# EAGLE design mydpi (EAGLE 9.6.2)
CHECKED_BY: -; DRAWN_BY: zaan; REV: 1.1; TITLE: myDPI
Assembly variants: BOM
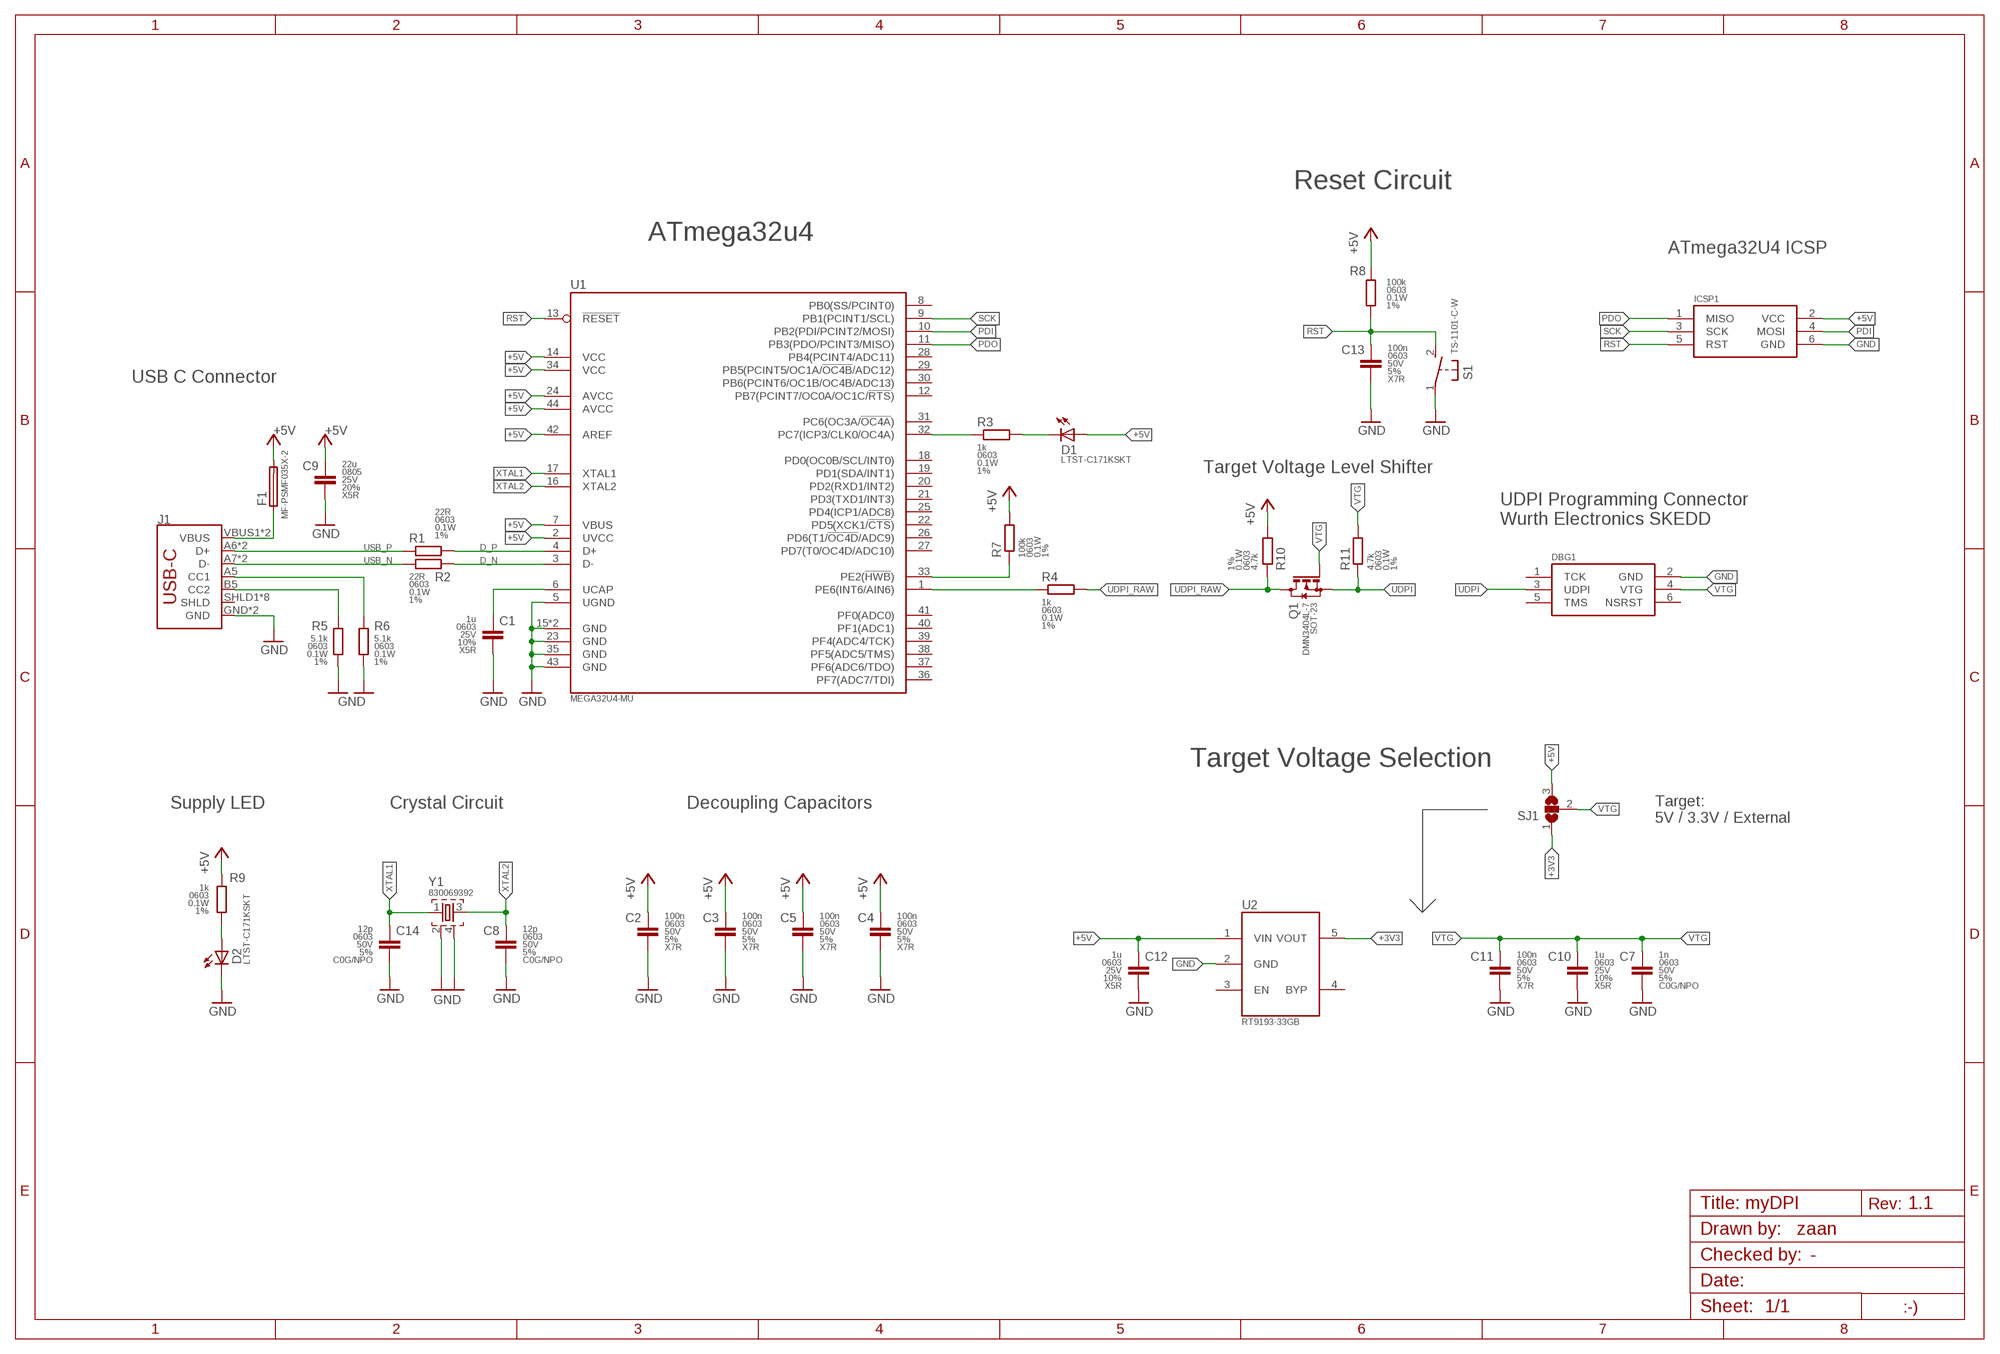
[diagram p0: schematic, sheet 1]

## Parts
C1  1u  1UF-0603-25V-10%  [C0603]
C2  100n  100NF-0603-50V-5%  [C0603]
C3  100n  100NF-0603-50V-5%  [C0603]
C4  100n  100NF-0603-50V-5%  [C0603]
C5  100n  100NF-0603-50V-5%  [C0603]
C7  1n  1NF-0603-50V-5%  [C0603]
C8  12p  12PF-0603-50V-5%  [C0603]
C9  22u  22UF-0805-25V-20%  [C0805]
C10  1u  1UF-0603-25V-10%  [C0603]
C11  100n  100NF-0603-50V-5%  [C0603]
C12  1u  1UF-0603-25V-10%  [C0603]
C13  100n  100NF-0603-50V-5%  [C0603]
C14  12p  12PF-0603-50V-5%  [C0603]
D1  LTST-C171KSKT  [CHIPLED_0805]
D2  LTST-C171KSKT  [CHIPLED_0805]
DBG1  AVR-UPDI-6-SKEDD  [490107670612_DEBUGGING]  (not fitted in variant BOM)
F1  MF-PSMF035X-2  [F0805]
ICSP1  AVR-ISP-SMD  [AVRISP-1.27-SMD]  (not fitted in variant BOM)
J1  USB_C2-LAYER  [USB-C-16P]
Q1  DMN3404L  [SOT23]
R1  22R  22OHM-0603-1/10W-1%  [R0603]
R2  22R  22OHM-0603-1/10W-1%  [R0603]
R3  1k  1KOHM-0603-1/10W-1%  [R0603]
R4  1k  1KOHM-0603-1/10W-1%  [R0603]
R5  5.1k  5.1KOHM-0603-1/10W-1%  [R0603]
R6  5.1k  5.1KOHM-0603-1/10W-1%  [R0603]
R7  100k  100KOHM-0603-1/10W-1%  [R0603]
R8  100k  100KOHM-0603-1/10W-1%  [R0603]
R9  1k  1KOHM-0603-1/10W-1%  [R0603]
R10  4.7k  4.7KOHM-0603-1/10W-1%  [R0603]
R11  4.7k  4.7KOHM-0603-1/10W-1%  [R0603]
S1  TS-1101-C-W  [SPST-6X3.6]
SJ1  SJ2W  [SJ_2]  (not fitted in variant BOM)
U1  MEGA32U4-MU  [TQFN44_7MM]
U2  RT9193-33GB  [SOT23-5]
Y1  830069392  [WE-XTAL_CFPX-218]

## Nets
+3V3: SJ1.1 U2.5(VOUT)
+5V: C2.1 C3.1 C4.1 C5.1 C9.1 C12.1 D1.A F1.2 ICSP1.2(VCC) R7.2 R8.2 R9.1 R10.2 SJ1.3 U1.2(UVCC) U1.7(VBUS) U1.14(VCC) U1.24(AVCC) U1.34(VCC) U1.42(AREF) U1.44(AVCC) U2.1(VIN)
D_N [usb]: R2.2 U1.3(D-)
D_P [usb]: R1.2 U1.4(D+)
GND: C1.2 C2.2 C3.2 C4.2 C5.2 C7.2 C8.2 C9.2 C10.2 C11.2 C12.2 C13.2 C14.2 D2.C DBG1.2(GND) ICSP1.6(GND) J1.GND J1.GND2(GND) R5.1 R6.1 S1.1(P) U1.5(UGND) U1.15(GND) U1.23(GND) U1.35(GND) U1.43(GND) U1.EXP(GND) U2.2(GND) Y1.2 Y1.4
N$1: R3.1 U1.32(PC7(ICP3/CLK0/OC4A))
N$2: D1.C R3.2
N$5: J1.B5(CC2) R5.2
N$6: J1.A5(CC1) R6.2
N$7: R7.1 U1.33(PE2(!HWB!))
N$8: C1.1 U1.6(UCAP)
N$9: D2.A R9.2
N$12: F1.1 J1.VBUS1(VBUS) J1.VBUS2(VBUS)
PDI: ICSP1.4(MOSI) U1.10(PB2(PDI/PCINT2/MOSI))
PDO: ICSP1.1(MISO) U1.11(PB3(PDO/PCINT3/MISO))
PE6: R4.1 U1.1(PE6(INT6/AIN6))
RST: C13.1 ICSP1.5(RST) R8.1 S1.2(S) U1.13(!RESET!)
SCK: ICSP1.3(SCK) U1.9(PB1(PCINT1/SCL))
UDPI: DBG1.3(UDPI) Q1.2(S) R11.1
UDPI_RAW: Q1.3(D) R4.2 R10.1
USB_N [usb]: J1.A7(D-) J1.B7(D-) R2.1
USB_P [usb]: J1.A6(D+) J1.B6(D+) R1.1
VTG: C7.1 C10.1 C11.1 DBG1.4(VTG) Q1.1(G) R11.2 SJ1.2
XTAL1: C14.1 U1.17(XTAL1) Y1.1
XTAL2: C8.1 U1.16(XTAL2) Y1.3
Unconnected: DBG1.1(TCK) DBG1.5(TMS) DBG1.6(NSRST) J1.SHLD1(SHLD) J1.SHLD2(SHLD) J1.SHLD3(SHLD) J1.SHLD4(SHLD) J1.SHLD5(SHLD) J1.SHLD6(SHLD) J1.SHLD7(SHLD) J1.SHLD8(SHLD) U1.8(PB0(SS/PCINT0)) U1.12(PB7(PCINT7/OC0A/OC1C/!RTS!)) U1.18(PD0(OC0B/SCL/INT0)) U1.19(PD1(SDA/INT1)) U1.20(PD2(RXD1/INT2)) U1.21(PD3(TXD1/INT3)) U1.22(PD5(XCK1/!CTS!)) U1.25(PD4(ICP1/ADC8)) U1.26(PD6(T1/!OC4D!/ADC9)) U1.27(PD7(T0/OC4D/ADC10)) U1.28(PB4(PCINT4/ADC11)) U1.29(PB5(PCINT5/OC1A/!OC4B!/ADC12)) U1.30(PB6(PCINT6/OC1B/OC4B/ADC13)) U1.31(PC6(OC3A/!OC4A!)) U1.36(PF7(ADC7/TDI)) U1.37(PF6(ADC6/TDO)) U1.38(PF5(ADC5/TMS)) U1.39(PF4(ADC4/TCK)) U1.40(PF1(ADC1)) U1.41(PF0(ADC0)) U2.3(EN) U2.4(BYP)

## Notes on the sheet
- Reset Circuit
- ATmega32u4
- ATmega32U4 ICSP
- USB C Connector
- Target Voltage Level Shifter
- UDPI Programming Connector
  Wurth Electronics SKEDD
- Target Voltage Selection
- Supply LED | Crystal Circuit | Decoupling Capacitors
- Target:
  5V / 3.3V / External

## Library data of the parts
C1 C10 C12 = zaan-Capacitors:1UF: 1uF capacitor; DESCRIPTION: Chip Capacitor; DIELECTRIC: X5R; MF: Yageo; MPN: CC0603KRX5R8BB105; PACKAGE: 1606; PACKAGE-IN: 0603; TOLERANCE: 10%; VOLTAGE: 25V
C2-C5 C11 C13 = zaan-Capacitors:100NF: 100nF capacitor; DESCRIPTION: Chip Capacitor; DIELECTRIC: X7R; MF: Yageo; MPN: CC0603JRX7R9BB104; PACKAGE: 1606; PACKAGE-IN: 0603; TOLERANCE: 5%; VOLTAGE: 50V
C7 = zaan-Capacitors:1NF: 1nF capacitor; DESCRIPTION: Chip Capacitor; DIELECTRIC: C0G/NPO; MF: Yageo; MPN: CC0603JRNPO9BN102; PACKAGE: 1608; PACKAGE-IN: 0603; TOLERANCE: 5%; VOLTAGE: 50V
C8 C14 = zaan-Capacitors:12PF: 12pF capacitor; DESCRIPTION: Chip Capacitor; DIELECTRIC: C0G/NPO; MF: Yageo; MPN: CC0603JRNPO9BN120; PACKAGE: 1606; PACKAGE-IN: 0603; TOLERANCE: 5%; VOLTAGE: 50V
C9 = zaan-Capacitors:22UF: 22uF capacitor; DESCRIPTION: Chip Capacitor; DIELECTRIC: X5R; MF: Murata; MPN: GRM21BR61E226ME44L; PACKAGE: 2012; PACKAGE-IN: 0805; TOLERANCE: 20%; VOLTAGE: 25V
D1 D2 = zaan-Optoelectronics:LTST: SMD LED Footprint: 0805 Source: Datasheet <http://optoelectronics.liteon.com/upload/download/ds22-2000-110/ltst-c171kskt.pdf> Manufacturer: Lite-On; DESCRIPTION: Surface Mount LED; MF: Lite-On; MPN: LTST-C171KSKT; PACKAGE: 2012; PACKAGE-IN: 0805
DBG1 = zaan-Connectors:AVR-UPDI-6
F1 = zaan-Fuses:MF-PSMF: PTC Resetable Fuse MF-PSMF Series - PTC Resettable Fuses Footprint: 0805 Source: Datasheet <https://www.bourns.com/data/global/pdfs/mfpsmf.pdf> Manufacturer: Bourns; DESCRIPTION: PTC Fuse; MF: Bourns; MPN: MF-PSMF035X-2; PACKAGE: 2012
ICSP1 = zaan-Connectors:AVR-ISP
J1 = zaan-Connectors:USB_C: USB Type C 16 Pin Connector Female 16 Pin Connector Footprint: USB-C 16P Source: Datasheet <https://datasheet.lcsc.com/szlcsc/1811101520_Jing-Extension-of-the-Electronic-Co-C167321_C167321.pdf> Manufacturer: Jing Extension of the Electronic Co. Super Speed pins not available on the 16-pin purely SMD connector so this part is best for USB 2.0 implementations. D1 and D2 are tied together enabling D+/- no matter which way the cable is plugged into the connector. The two channel configuration pins (CC1/2) are exposed. These are normally connected to ground via 5.1k resistors but can be reconfigured for high current/high power applications.; DESCRIPTION: USB Type C Female; MF: Jing Extension; MPN: C167321; PACKAGE: USB-C 16P
Q1 = zaan-Discrete:DMN3404L: N-CHANNEL MOS FET N-Channel Logic Level Enhancement Mode Field Effect Transistor Footprint: SOT-23 Source: Datasheet <https://www.diodes.com/assets/Datasheets/ds31787.pdf> Manufacturer: Diodes Incorporated; DESCRIPTION: N-CHANNEL MOSFET; MF: Diodes Incorporated; MPN: DMN3404L-7; PACKAGE: SOT-23
R1 R2 = zaan-Resistors:22OHM: 22Ω resistor; DESCRIPTION: Chip Resistor; MF: Yageo; MPN: RC0603FR-0722RL; PACKAGE: 1608; PACKAGE-IN: 0603; POWER: 0.1W; TOLERANCE: 1%; VOLTAGE: 75V
R3 R4 R9 = zaan-Resistors:1KOHM: 1kΩ resistor; DESCRIPTION: Chip Resistor; MF: Yageo; MPN: RC0603FR-071KL; PACKAGE: 1608; PACKAGE-IN: 0603; POWER: 0.1W; TOLERANCE: 1%; VOLTAGE: 75V
R5 R6 = zaan-Resistors:5.1KOHM: 5.1kΩ resistor; DESCRIPTION: Chip Resistor; MF: Yageo; MPN: RC0603FR-075K1L; PACKAGE: 1608; PACKAGE-IN: 0603; POWER: 0.1W; TOLERANCE: 1%; VOLTAGE: 75V
R7 R8 = zaan-Resistors:100KOHM: 100kΩ resistor; DESCRIPTION: Chip Resistor; MF: Yageo; MPN: RC0603FR-07100KL; PACKAGE: 1608; PACKAGE-IN: 0603; POWER: 0.1W; TOLERANCE: 1%; VOLTAGE: 75V
R10 R11 = zaan-Resistors:4.7KOHM: 4.7kΩ resistor; DESCRIPTION: Chip Resistor; MF: Yageo; MPN: RC0603FR-074K7L; PACKAGE: 1608; PACKAGE-IN: 0603; POWER: 0.1W; TOLERANCE: 1%; VOLTAGE: 75V
S1 = zaan-Electromechanical:TS-1101-C: Tactile Button SPST Footprint: 6.1X3.6X2.5 Source: Datasheet <https://datasheet.lcsc.com/szlcsc/1811082126_Korean-Hroparts-Elec-K2-1107ST-A4SW-06_C118141.pdf> Manufacturer: ON Semiconductor; DESCRIPTION: Tactile Button; MF: Korean Hroparts Elec; MPN: K2-1107ST-A4SW-06; PACKAGE: 6.1X3.6X2.5
SJ1 = jumper:SJ2W: SMD solder JUMPER
U1 = zaan-IC-Microcontroller:MEGA32U4: ATmega32u4 8-bit Microcontroller with 16/32K bytes of ISP Flash and USB Controller Footprint: QFN-44 Source: Datasheet <http://ww1.microchip.com/downloads/en/devicedoc/atmel-7766-8-bit-avr-atmega16u4-32u4_datasheet.pdf> Manufacturer: Atmel; DESCRIPTION: Microcontroller; MF: Atmel; MPN: ATMEGA32U4-MU; PACKAGE: QFN-44
U2 = zaan-IC-Power:RT9193: LDO Regulator 300mA, Ultra-Low Noise, Ultra-Fast CMOS LDO Regulator Footprint: SOT-23-5 Source: Datasheet <https://www.richtek.com/assets/product_file/RT9193/DS9193-16.pdf> Manufacturer: Richtek; DESCRIPTION: Low Dropout Regulator; MF: Richtek; MPN: RT9193-33GB; PACKAGE: SOT-23-5
Y1 = zaan-Electromechanical:830069: Crystal SMD Crystal Footprint: 2520 Source: Datasheet <https://www.we-online.de/katalog/de/WE-XTAL/> Manufacturer: Wurth Electronics; DESCRIPTION: Crystal; MF: Wurth Electronics; MPN: 830069392; PACKAGE: 2520

## Net classes
0 default: width 0.254 mm, drill 0.3 mm
1 usb: width 0.254 mm, drill 0.3 mm, clearance 0.2 mm

## Board
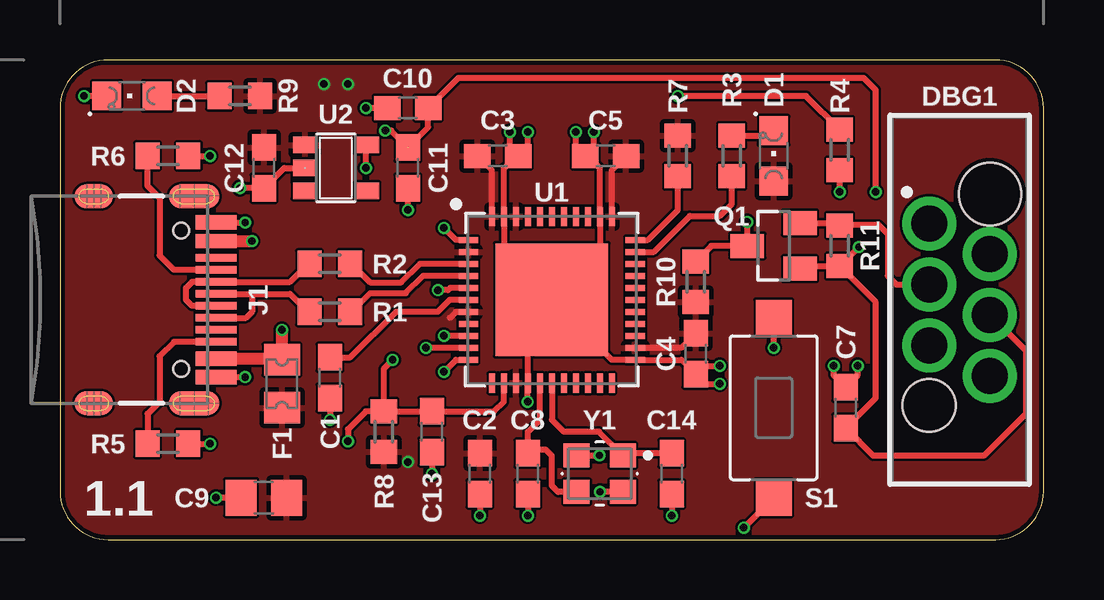
[diagram p1: board, top side]
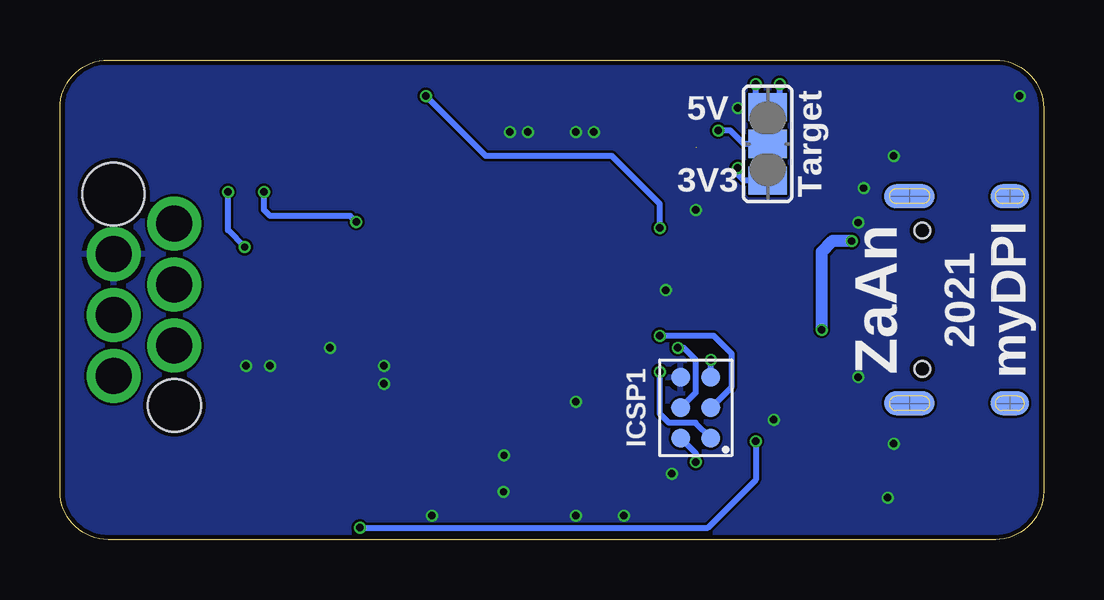
[diagram p2: board, bottom side, seen from below]

Size 41 x 20 mm. Coordinates in mm from the lower left corner, seen from the top.
Outline: 0,18 0,2 arc90 2,0 39,0 arc90 41,2 41,18 arc90 39,20 2,20 arc90 0,18
Copper layers (1*16): Top 0.035mm / dielectric 1.55mm / Bottom 0.035mm
Design rules "Multi-CB_2L *": minimum track width 0.1mm, minimum drill 0.2mm, track to track 0.1mm, track to pad 0.1mm, pad to pad 0.1mm, via to via 0.1mm, smd to smd 0mil, copper to edge 0.2mm, drill to drill 0.2mm, minimum pad ring 0.125mm, minimum via ring 0.1mm, stop-mask expansion 2mil, vias tented up to drill 0.45mm, thermal gap 0.2mm

### Footprints (pad centres in the part's own frame; a part is rotated, then mirrored left to right if it is on the bottom)
C0603 = smd 1.1 x 1: 1 -0.85,0; 2 0.85,0
C0805 = smd 1.3 x 1.5: 1 -0.95,0; 2 0.95,0
CHIPLED_0805 = smd 1.2 x 1.2: A 0,-1.05; C 0,1.05
490107670612_DEBUGGING = drill 1.5 pad 1.825: 1 3.175,1.27; 2 1.905,-1.27; 3 0.635,1.27; 4 -0.635,-1.27; 5 -1.905,1.27; 6 -3.175,-1.27 | hole 2.2: -4.405,1.27 | hole 2.6: 4.405,-1.27
F0805 = smd 1.3 x 1.5: 1 -1,0; 2 1,0
AVRISP-1.27-SMD = smd 0.8 x 0.8: 1 -0.635,1.27; 2 0.635,1.27; 3 -0.635,0; 4 0.635,0; 5 -0.635,-1.27; 6 0.635,-1.27
USB-C-16P = smd 0.3 x 1.7: A5 -1.25,4.01; A6 -0.25,4.01; A7 0.25,4.01; A8 1.25,4.01; B5 1.75,4.01; B6 0.75,4.01; B7 -0.75,4.01; B8 -1.75,4.01 | smd 0.6 x 1.7: GND -3.225,4.01; GND2 3.225,4.01; VBUS1 -2.45,4.01; VBUS2 2.45,4.01 | smd 1 x 2.1: SHLD1 -4.32,3.085; SHLD2 4.32,3.085 | smd 1 x 2.1 bottom: SHLD3 -4.32,3.085; SHLD4 4.32,3.085 | smd 1 x 1.6: SHLD5 -4.32,-1.095; SHLD8 4.32,-1.095 | smd 1 x 1.6 bottom: SHLD6 -4.32,-1.095; SHLD7 4.32,-1.095 | hole 0.65: -2.89,2.555; 2.89,2.555
SOT23 = smd 1 x 1.4: 1 -0.95,-1.1; 2 0.95,-1.1; 3 0,1.1
R0603 = smd 1 x 1.1: 1 -0.85,0; 2 0.85,0
SPST-6X3.6 = smd 1.5 x 1.5: 1 -3.75,0; 2 3.75,0
SJ_2 = smd 1.168 x 1.6: 1 -1.524,0; 2 0,0; 3 1.524,0
TQFN44_7MM = smd 0.8 x 0.25: 1 -3.475,2.5; 2 -3.475,2; 3 -3.475,1.5; 4 -3.475,1; 5 -3.475,0.5; 6 -3.475,0; 7 -3.475,-0.5; 8 -3.475,-1; 9 -3.475,-1.5; 10 -3.475,-2; 11 -3.475,-2.5; 23 3.475,-2.5; 24 3.475,-2; 25 3.475,-1.5; 26 3.475,-1; 27 3.475,-0.5; 28 3.475,0; 29 3.475,0.5; 30 3.475,1; 31 3.475,1.5; 32 3.475,2; 33 3.475,2.5 | smd 0.25 x 0.8: 12 -2.5,-3.475; 13 -2,-3.475; 14 -1.5,-3.475; 15 -1,-3.475; 16 -0.5,-3.475; 17 0,-3.475; 18 0.5,-3.475; 19 1,-3.475; 20 1.5,-3.475; 21 2,-3.475; 22 2.5,-3.475; 34 2.5,3.475; 35 2,3.475; 36 1.5,3.475; 37 1,3.475; 38 0.5,3.475; 39 0,3.475; 40 -0.5,3.475; 41 -1,3.475; 42 -1.5,3.475; 43 -2,3.475; 44 -2.5,3.475 | smd 4.7 x 4.7: EXP 0,0
SOT23-5 = smd 0.69 x 0.99: 1 -0.95,-1.29; 2 0,-1.29; 3 0.95,-1.29; 4 0.95,1.3; 5 -0.95,1.3
WE-XTAL_CFPX-218 = smd 1.087 x 0.987: 1 -0.963,-0.762; 2 0.963,-0.762; 3 0.963,0.762; 4 -0.963,0.762

### Placement (x,y rotation side)
C1  11.25,6.75 270 top
C2  17.5,2.75 270 top
C3  18.25,16 0 top
C4  26.5,7.75 270 top
C5  22.75,16 180 top
C7  32.75,5.5 90 top
C8  19.5,2.75 270 top
C9  8.5,1.75 180 top
C10  14.5,18 180 top
C11  14.5,15.5 270 top
C12  8.5,15.5 270 top
C13  15.5,4.5 270 top
C14  25.5,2.75 270 top
D1  29.75,16 0 top
D2  3,18.5 90 top
DBG1  37.5,10 90 top
F1  9.25,6.5 270 top
ICSP1  14.5,5.5 180 bottom
J1  2.5,10 270 top
Q1  29.75,12.25 90 top
R1  11.25,9.5 0 top
R2  11.25,11.5 0 top
R3  28,16 90 top
R4  32.5,16.25 270 top
R5  4.5,4 180 top
R6  4.5,16 180 top
R7  25.75,16 90 top
R8  13.5,4.5 270 top
R9  7.5,18.5 180 top
R10  26.5,10.75 270 top
R11  32.5,12.25 270 top
S1  29.75,5.5 270 top
SJ1  11.5,16.5 90 bottom
U1  20.5,10 0 top
U2  11.5,15.5 270 top
Y1  22.5,2.75 180 top

### Tracks (layer width: path | path; a pad name or v marks a point on that pad's centre or on a via)
+3V3  (via drill 0.3)
  Top 0.254: v12.75,15.5 12.75,16.4 U2.5
  Bottom 0.254: v12.75,15.5 12.75,15.23 12.5,14.98 SJ1.1
+5V  (via drill 0.3)
  Top 0.254: C4.1 25.9,8 U1.24 | U1.34 23,15.4 C5.1 | C3.1 18,15.4 U1.44 | U1.7 16.5,9.5 16.25,9.25
  Bottom 0.254: v12,19 12,18.52 SJ1.3 11,18.52 v11,19 | ICSP1.2 14.5,3.6 v14.5,3.23
  pour Top: 2,20 39,20 arc-90 41,18 41,2 arc-90 39,0 2,0 arc-90 0,2 0,18 arc-90
D_N
  Top 0.254: U1.3 15,11.5 14.23,10.73 12.93,10.73 12.16,11.5 R2.2
D_P
  Top 0.254: U1.4 15.14,11 14.41,10.27 12.93,10.27 12.16,9.5 R1.2
GND  (via drill 0.3)
  Top 0.254: R5.1 v6.25,4 | R6.1 v6.25,16 | J1.GND2 v7.72,6.78 | J1.GND v7.72,13.22 | D2.C v1,18.5 | C8.2 v19.5,1 | C14.2 v25.5,1 | C2.2 v17.5,1 | Y1.2 v22.49,3.51 | Y1.4 v22.51,1.99 | C3.2 19.35,16.25 | C3.2 19.05,16.05 | 19.05,16.05 18.75,16.35 v18.75,17 | C3.2 19.5,16.4 v19.5,17 | v21.5,17 21.5,16.4 C5.2 21.95,16.05 | 21.95,16.05 22.25,16.35 v22.25,17 | 18.5,12 U1.43 18.5,15.5 19.05,16.05 | 22.5,12 U1.35 22.5,15.5 21.95,16.05 | 22.75,7.75 23,7.5 U1.23 25.9,7.5 C4.2 | v33.25,7.25 33.25,6.85 C7.2 32.25,6.85 v32.25,7.25 | C1.2 v11.25,5 | C4.2 26.85,7.25 v27.5,7.25 | C4.2 26.9,6.5 v27.5,6.5 | v19.5,5.75 U1.15 19.5,9 U1.EXP | U1.5 16.27,10.5 16.17,10.4 v15.75,10.4 | v29.75,8 S1.1 | C13.2 v15.5,2.75 | C9.2 v6.5,1.75 | C12.2 8.4,14.75 | v14.5,13.75 C11.2 | C10.2 v12.75,18 | C12.2 v7.5,14.65 | C12.2 9.35,15.5 U2.2
  pour Bottom: 2,20 39,20 arc-90 41,18 41,2 arc-90 39,0 2,0 arc-90 0,2 0,18 arc-90
N$1
  Top 0.254: U1.32 24.75,12 26.25,13.5 27.5,13.5 28,14 R3.1
N$2
  Top 0.254: R3.2 29.55,16.85 D1.C
N$5
  Top 0.254: J1.B5 4.75,8.25 4.15,7.65 4.15,5.75 3.65,5.25 R5.2
N$6
  Top 0.254: J1.A5 4.75,11.25 4.15,11.85 4.15,14.25 3.65,14.75 R6.2
N$7
  Top 0.254: U1.33 24.5,12.5 25.75,13.75 R7.1
N$8
  Top 0.254: C1.1 12.1,7.6 14,9.5 15.75,9.5 16.25,10 U1.6
N$9
  Top 0.254: D2.A R9.2
N$12  (via drill 0.3)
  Top 0.508: J1.VBUS2 9.2,7.55 F1.1 v9.25,8.75 | J1.VBUS1 v8,12.45
  Bottom 0.508: v8,12.45 8.8,12.45 9.25,12 v9.25,8.75
PDI  (via drill 0.3)
  Top 0.254: v15.25,8 U1.10
  Bottom 0.254: ICSP1.4 14.5,6.13 14.5,7.5 15,8 v15.25,8
PDO  (via drill 0.3)
  Top 0.254: v16,7 16.5,7.5 U1.11
  Bottom 0.254: ICSP1.1 14.51,4.87 15.62,4.87 16,5.25 v16,7
PE6  (via drill 0.3)
  Top 0.254: U1.1 16.5,12.5 v16,13 | v25.75,18.5 31.1,18.5 R4.1
  Bottom 0.254: v16,13 16,14 18,16 23.25,16 v25.75,18.5
RST  (via drill 0.3)
  Top 0.254: U1.13 18.5,5.75 18.1,5.35 C13.1 R8.1 | R8.1 13.5,7.13 v13.87,7.5 | R8.1 12.75,5.35 12,4.6 v12,4.1 | S1.2 v28.5,0.5
  Bottom 0.254: ICSP1.5 v13.87,7.5 | v12,4.1 12,2.5 14,0.5 v28.5,0.5
SCK  (via drill 0.3)
  Top 0.254: U1.9 v16,8.5
  Bottom 0.254: ICSP1.3 13,6.37 13,7.75 13.75,8.5 v16,8.5
UDPI
  Top 0.254: DBG1.3 34.87,10.63 34.5,11 34.5,12.75 34.12,13.12 32.52,13.12 R11.1 32.4,13.2 Q1.2
UDPI_RAW  (via drill 0.3)
  Top 0.254: R10.1 27.15,12.25 Q1.3 v28.65,13.25 | v32.5,14.5 R4.2
  Bottom 0.254: v28.65,13.25 28.9,13.5 32.25,13.5 32.5,13.75 v32.5,14.5
USB_N
  Top 0.254: R2.1 10.34,11.5 9.59,10.75 J1.B7 | J1.B7 6.53,10.73 | J1.A7 5.5,9.75 5.25,10 5.25,10.5 5.5,10.75 J1.B7
USB_P
  Top 0.254: R1.1 10.34,9.5 9.59,10.25 8,10.25 | 6.53,10.27 J1.A6 8,10.25 | J1.B6 7.75,9.25 8,9.5 8,10.25
VTG  (via drill 0.3)  (1 unrouted)
  Top 0.254: C11.1 15.35,17.2 C10.1 16.6,19.25 33.5,19.25 34,18.75 v34,14.5 | 14.5,16.37 13.81,17.06 v13.56,17.06 | DBG1.4 40.25,7.88 40.25,5.25 38.5,3.5 33.9,3.5 C7.1 34,5.9 34,9.9 R11.2 | Q1.1 30.95,11.4 R11.2 | R11.2 v33.3,12.2
  Bottom 0.254: 11.5,18 SJ1.2 12.5,16.5 13.06,17.06 v13.56,17.06 | v33.3,12.2 34,12.9 v34,14.5
XTAL1
  Top 0.254: U1.17 20.5,5 21,4.5 22.48,4.5 Y1.1 23.55,3.6 C14.1
XTAL2
  Top 0.254: Y1.3 20.76,1.99 20.5,2.25 20.5,3.5 20.25,3.75 19.5,3.75 C8.1 19.5,4.5 20,5 U1.16

### Text on the board
bNames: 5V | Target | 3V3 | myDPI | 2021 | ZaAn